# EAGLE design FAL65816_Audio (EAGLE 7.2.0)
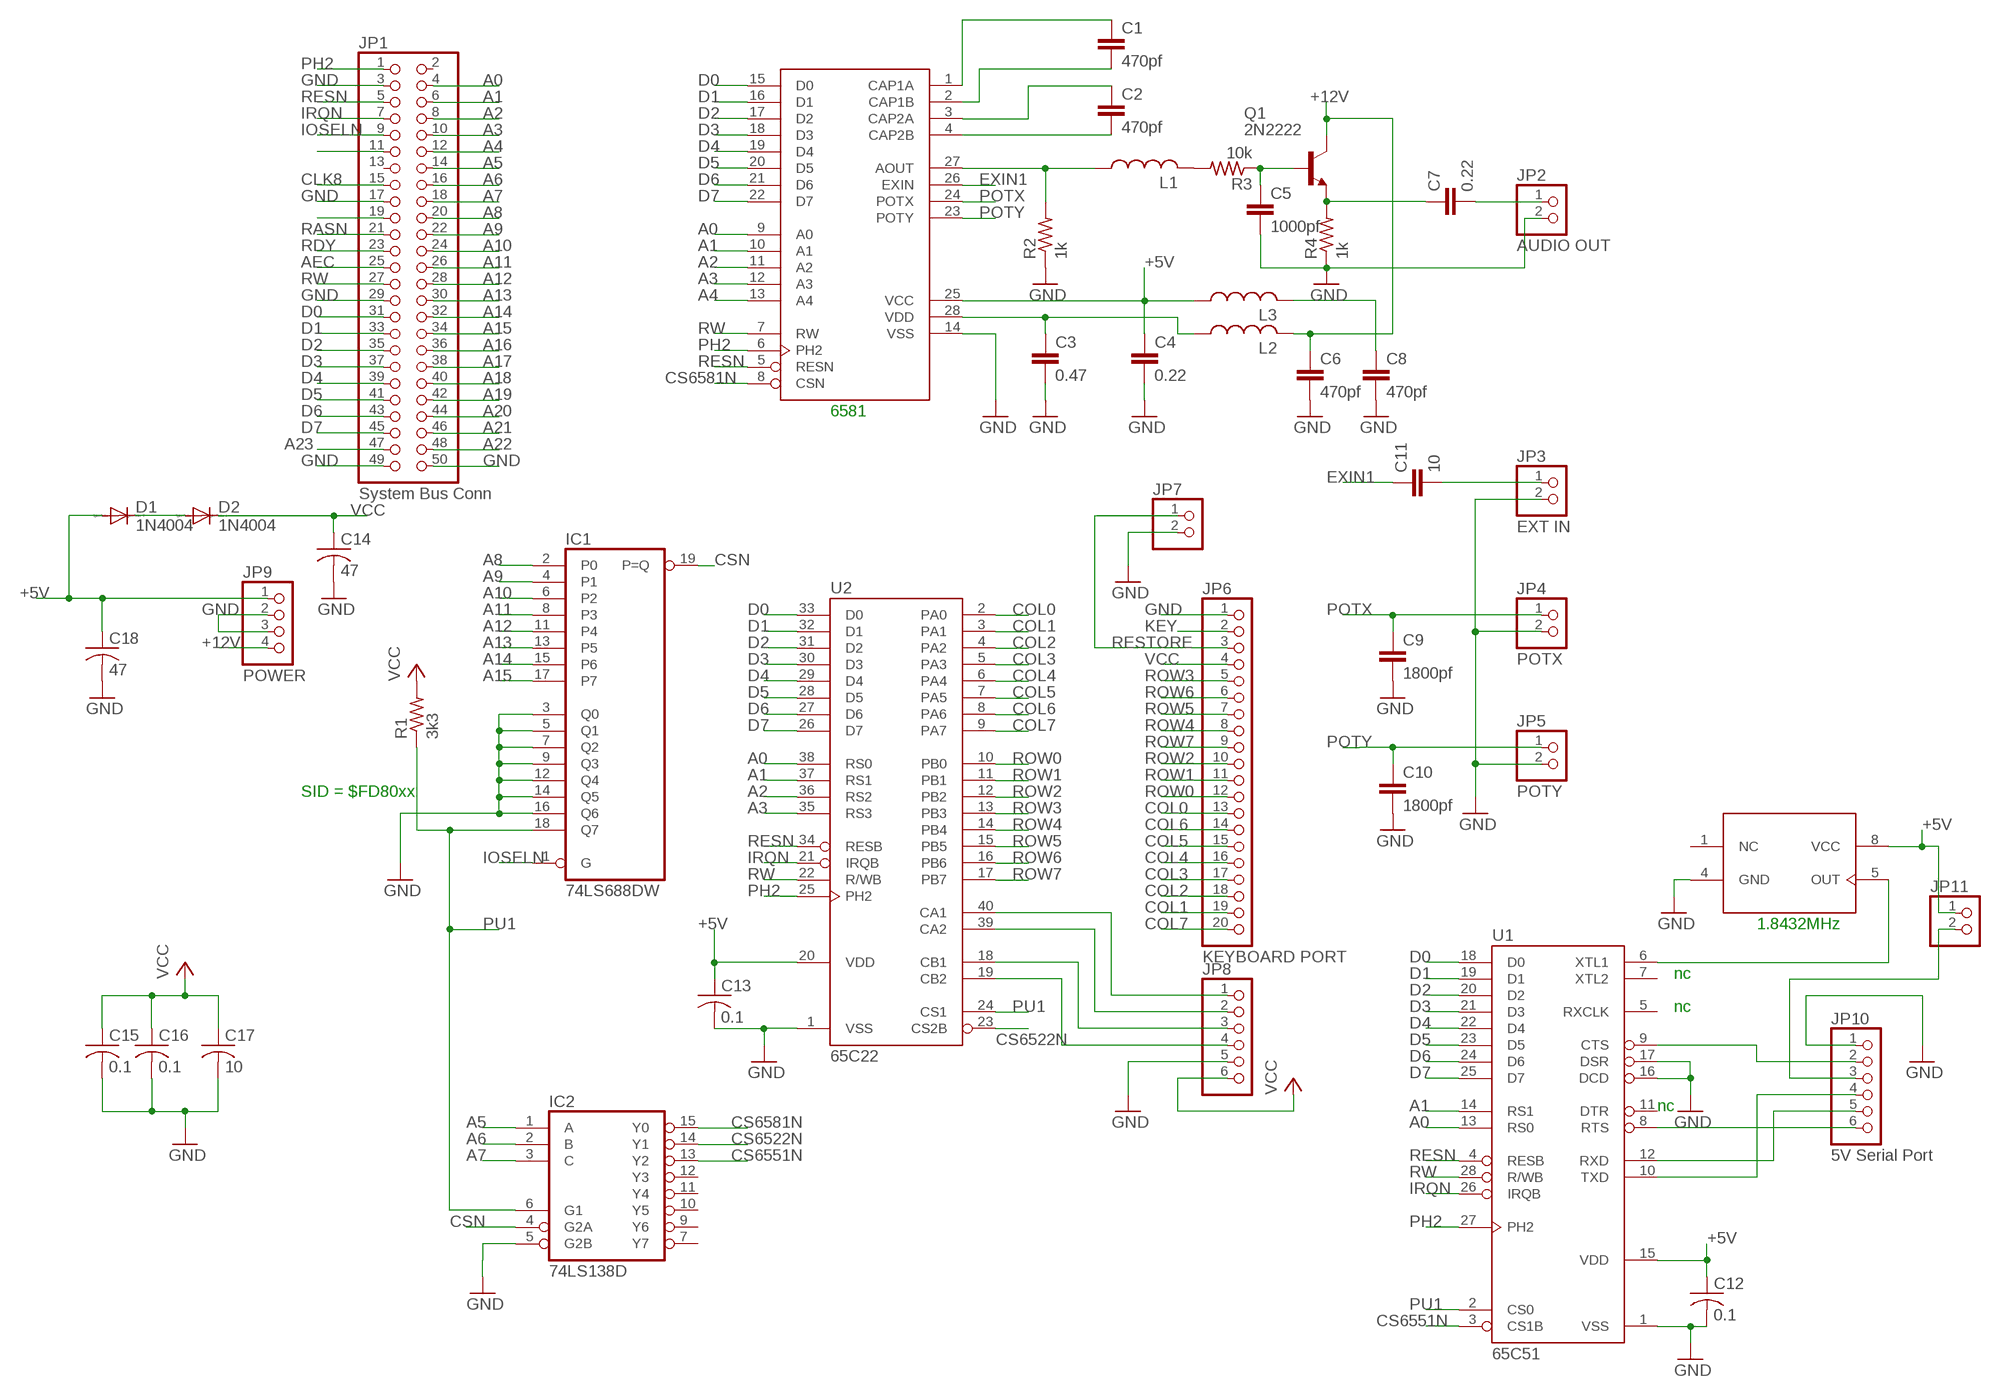
[diagram p0: schematic, sheet 1]

## Parts
C1  470pf  C-EU050-024X044  [C050-024X044]
C2  470pf  C-EU050-024X044  [C050-024X044]
C3  0.47  C-EU050-024X044  [C050-024X044]
C4  0.22  C-EU050-024X044  [C050-024X044]
C5  1000pf  C-EU050-024X044  [C050-024X044]
C6  470pf  C-EU050-024X044  [C050-024X044]
C7  0.22  C-EU050-024X044  [C050-024X044]
C8  470pf  C-EU050-024X044  [C050-024X044]
C9  1800pf  C-EU050-024X044  [C050-024X044]
C10  1800pf  C-EU050-024X044  [C050-024X044]
C11  10  C-EU050-024X044  [C050-024X044]
C12  0.1  C-US050-024X044  [C050-024X044]
C13  0.1  C-US050-024X044  [C050-024X044]
C14  47  C-US050-024X044  [C050-024X044]
C15  0.1  C-US050-024X044  [C050-024X044]
C16  0.1  C-US050-024X044  [C050-024X044]
C17  10  C-US050-024X044  [C050-024X044]
C18  47  C-US050-024X044  [C050-024X044]
D1  1N4004  [DO41-10]
D2  1N4004  [DO41-10]
IC1  74LS688DW  [SO20W]
IC2  74LS138D  [SO16]
JP1  System Bus Conn  PINHD-2X25/90  [2X25/90]
JP2  AUDIO OUT  PINHD-1X2  [1X02]
JP3  EXT IN  PINHD-1X2  [1X02]
JP4  POTX  PINHD-1X2  [1X02]
JP5  POTY  PINHD-1X2  [1X02]
JP6  KEYBOARD PORT  PINHD-1X20  [1X20]
JP7  PINHD-1X2  [1X02]
JP8  PINHD-1X6/90  [1X06/90]
JP9  POWER  PINHD-1X4/90  [1X04/90]
JP10  5V Serial Port  PINHD-1X6/90  [1X06/90]
JP11  PINHD-1X2  [1X02]
L1  L-US0204/7  [0204/7]
L2  L-US0204/7  [0204/7]
L3  L-US0204/7  [0204/7]
Q1  2N2222  [TO18]
R1  3k3  R-US_0204/7  [0204/7]
R2  1k  R-US_0204/7  [0204/7]
R3  10k  R-US_0204/7  [0204/7]
R4  1k  R-US_0204/7  [0204/7]
U1  65C51  G65SC51P  [DIP-28]
U2  65C22  G65SC22P  [DIP-40]
U$1  6581  FT6581  [DIP-28]
U$2  1.8432MHz  OSC  [DIL08]

## Nets
+5V: C4.1 C12.1 C13.1 C18.1 D1.A JP9.1 JP11.1 L3.1 U1.15(VDD) U2.20(VDD) U$1.25(VCC) U$2.8(VCC)
+12V: C6.1 JP9.4 L2.2 Q1.3(C)
A0: JP1.4 U1.13(RS0) U2.38(RS0) U$1.9(A0)
A1: JP1.6 U1.14(RS1) U2.37(RS1) U$1.10(A1)
A2: JP1.8 U2.36(RS2) U$1.11(A2)
A3: JP1.10 U2.35(RS3) U$1.12(A3)
A4: JP1.12 U$1.13(A4)
A5: IC2.1(A) JP1.14
A6: IC2.2(B) JP1.16
A7: IC2.3(C) JP1.18
A8: IC1.2(P0) JP1.20
A9: IC1.4(P1) JP1.22
A10: IC1.6(P2) JP1.24
A11: IC1.8(P3) JP1.26
A12: IC1.11(P4) JP1.28
A13: IC1.13(P5) JP1.30
A14: IC1.15(P6) JP1.32
A15: IC1.17(P7) JP1.34
A16: JP1.36
A17: JP1.38
A18: JP1.40
A19: JP1.42
A20: JP1.44
A21: JP1.46
A22: JP1.48
A23: JP1.47
AEC: JP1.25
CLK8: JP1.15
COL0: JP6.13 U2.2(PA0)
COL1: JP6.19 U2.3(PA1)
COL2: JP6.18 U2.4(PA2)
COL3: JP6.17 U2.5(PA3)
COL4: JP6.16 U2.6(PA4)
COL5: JP6.15 U2.7(PA5)
COL6: JP6.14 U2.8(PA6)
COL7: JP6.20 U2.9(PA7)
CS6522N: IC2.14(Y1) U2.23(CS2B)
CS6551N: IC2.13(Y2) U1.3(CS1B)
CS6581N: IC2.15(Y0) U$1.8(CSN)
CSN: IC1.19(P=Q) IC2.4(G2A)
D0: JP1.31 U1.18(D0) U2.33(D0) U$1.15(D0)
D1: JP1.33 U1.19(D1) U2.32(D1) U$1.16(D1)
D2: JP1.35 U1.20(D2) U2.31(D2) U$1.17(D2)
D3: JP1.37 U1.21(D3) U2.30(D3) U$1.18(D3)
D4: JP1.39 U1.22(D4) U2.29(D4) U$1.19(D4)
D5: JP1.41 U1.23(D5) U2.28(D5) U$1.20(D5)
D6: JP1.43 U1.24(D6) U2.27(D6) U$1.21(D6)
D7: JP1.45 U1.25(D7) U2.26(D7) U$1.22(D7)
EXIN1: C11.1 U$1.26(EXIN)
GND: C3.2 C4.2 C5.2 C6.2 C8.2 C9.2 C10.2 C12.2 C13.2 C14.2 C15.2 C16.2 C17.2 C18.2 IC1.3(Q0) IC1.5(Q1) IC1.7(Q2) IC1.9(Q3) IC1.12(Q4) IC1.14(Q5) IC1.16(Q6) IC2.5(G2B) JP1.3 JP1.17 JP1.29 JP1.49 JP1.50 JP2.2 JP3.2 JP4.2 JP5.2 JP6.1 JP7.2 JP8.5 JP9.2 JP9.3 JP10.1 R2.1 R4.1 U1.1(VSS) U1.16(DCD) U1.17(DSR) U2.1(VSS) U$1.14(VSS) U$2.4(GND)
IOSELN: IC1.1(G) JP1.9
IRQN: JP1.7 U1.26(IRQB) U2.21(IRQB)
KEY: JP6.2
N$1: C1.1 U$1.1(CAP1A)
N$2: C1.2 U$1.2(CAP1B)
N$3: C2.1 U$1.3(CAP2A)
N$4: C2.2 U$1.4(CAP2B)
N$5: L1.1 R2.2 U$1.27(AOUT)
N$6: C3.1 L2.1 U$1.28(VDD)
N$7: L1.2 R3.2
N$8: C5.1 Q1.2(B) R3.1
N$9: C7.1 Q1.1(E) R4.2
N$10: D1.C D2.A
N$11: C7.2 JP2.1
N$12: C8.1 L3.2
N$14: JP10.3 JP11.2
N$16: C11.2 JP3.1
N$17: JP10.2 U1.9(CTS)
N$18: JP1.19
N$20: JP10.4 U1.10(TXD)
N$21: JP10.5 U1.12(RXD)
N$22: JP10.6 U1.8(RTS)
N$23: JP8.1 U2.40(CA1)
N$24: JP8.2 U2.39(CA2)
N$25: JP8.3 U2.18(CB1)
N$26: JP8.4 U2.19(CB2)
N$28: U1.6(XTL1) U$2.5(OUT)
N$40: JP1.11
PH2: JP1.1 U1.27(PH2) U2.25(PH2) U$1.6(PH2)
POTX: C9.1 JP4.1 U$1.24(POTX)
POTY: C10.1 JP5.1 U$1.23(POTY)
PU1: IC1.18(Q7) IC2.6(G1) R1.1 U1.2(CS0) U2.24(CS1)
RASN: JP1.21
RDY: JP1.23
RESN: JP1.5 U1.4(RESB) U2.34(RESB) U$1.5(RESN)
RESTORE: JP6.3 JP7.1
ROW0: JP6.12 U2.10(PB0)
ROW1: JP6.11 U2.11(PB1)
ROW2: JP6.10 U2.12(PB2)
ROW3: JP6.5 U2.13(PB3)
ROW4: JP6.8 U2.14(PB4)
ROW5: JP6.7 U2.15(PB5)
ROW6: JP6.6 U2.16(PB6)
ROW7: JP6.9 U2.17(PB7)
RW: JP1.27 U1.28(R/WB) U2.22(R/WB) U$1.7(RW)
VCC: C14.1 C15.1 C16.1 C17.1 D2.C JP6.4 JP8.6 R1.2
Unconnected: IC2.7(Y7) IC2.9(Y6) IC2.10(Y5) IC2.11(Y4) IC2.12(Y3) JP1.2 JP1.13 U1.5(RXCLK) U1.7(XTL2) U1.11(DTR) U$2.1(NC)

## Notes on the sheet
- 6581
- SID = $FD80xx
- 1.8432MHz
- nc
- nc
- nc

## Power pins joined to a net without a drawn wire
GND: IC1.10(GND) IC2.8(GND)
VCC: IC1.20(VCC) IC2.16(VCC)

## Library data of the parts
C1-C11 = rcl:C-EU: CAPACITOR, European symbol
C12-C18 = resistor:C-US: CAPACITOR, American symbol
D1 D2 = diode:1N4004: DIODE general purpose rectifier, 1 A
IC1 = FT74xx:74*688: 8-bit MAGNITUDE/IDENTITY COMPARATOR, totem pole
IC2 = FT74xx:74*138: 3-line to 8-line DECODER/DEMULTIPLEXER
JP1 = pinhead:PINHD-2X25: PIN HEADER
JP2-JP5 JP7 JP11 = pinhead:PINHD-1X2: PIN HEADER
JP6 = pinhead:PINHD-1X20: PIN HEADER
JP8 JP10 = pinhead:PINHD-1X6: PIN HEADER
JP9 = pinhead:PINHD-1X4: PIN HEADER
L1-L3 = resistor:L-US: INDUCTOR, American symbol
Q1 = transistor-npn:2N2222*: NPN Transistor
R1-R4 = resistor:R-US_: RESISTOR, American symbol
U1 = 65xxx:G65SC51P: California Micro Devices Version
U2 = 65xxx:G65SC22P: California Micro Devices Version
U$1 = 65xxx:FT6581: Sound interface device
U$2 = FT74xx:OSC

## Board
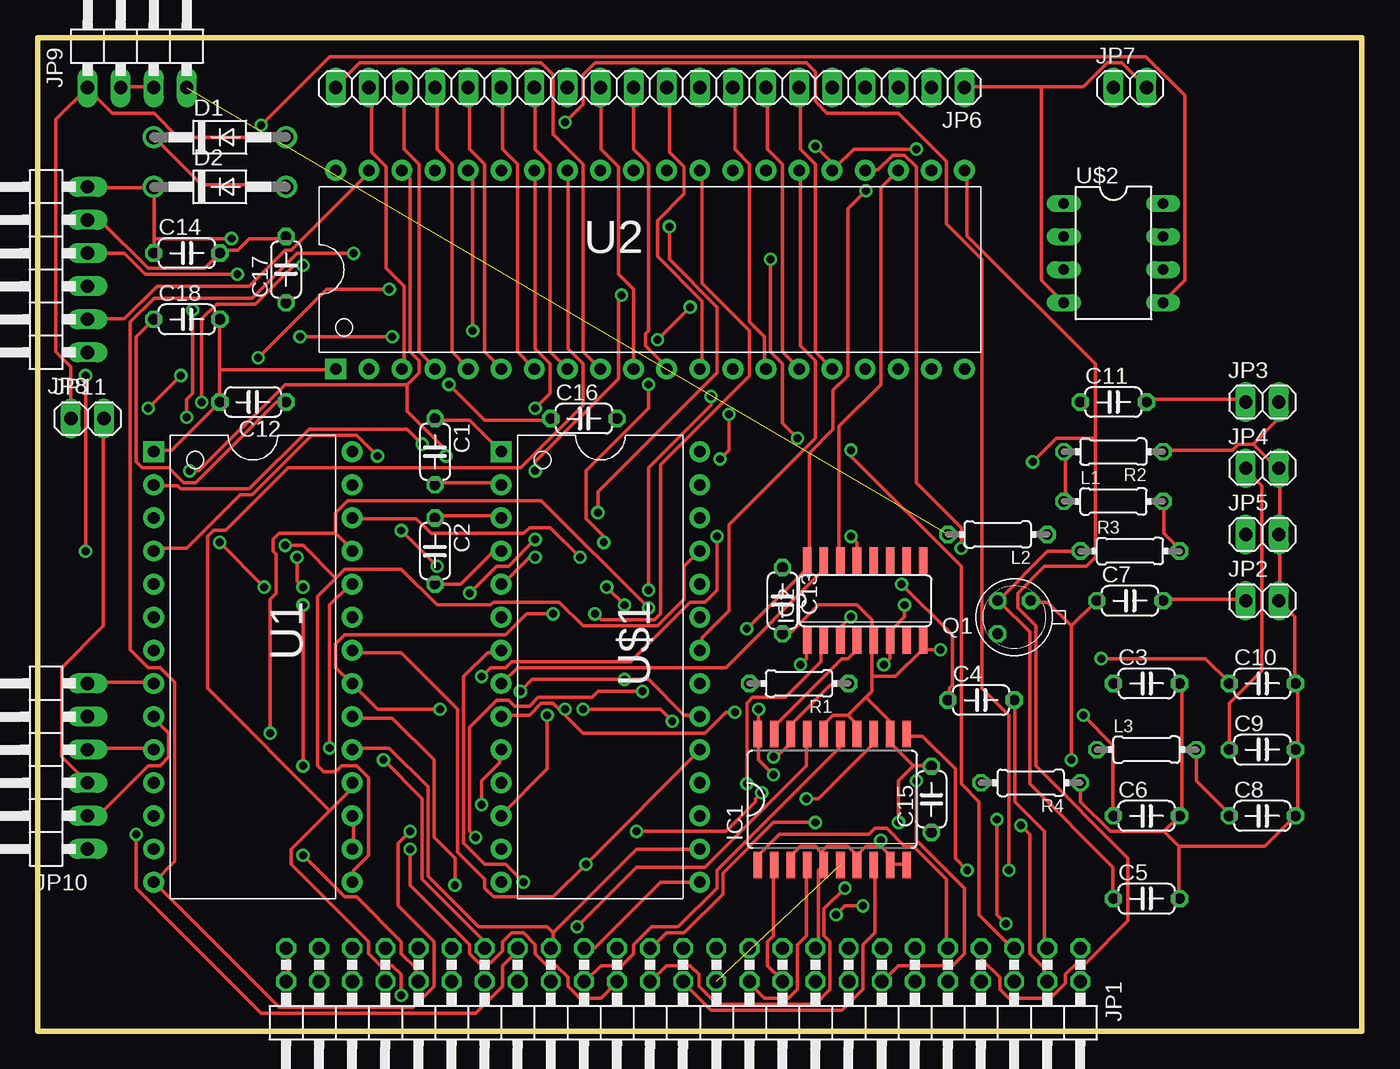
[diagram p1: board, top side]
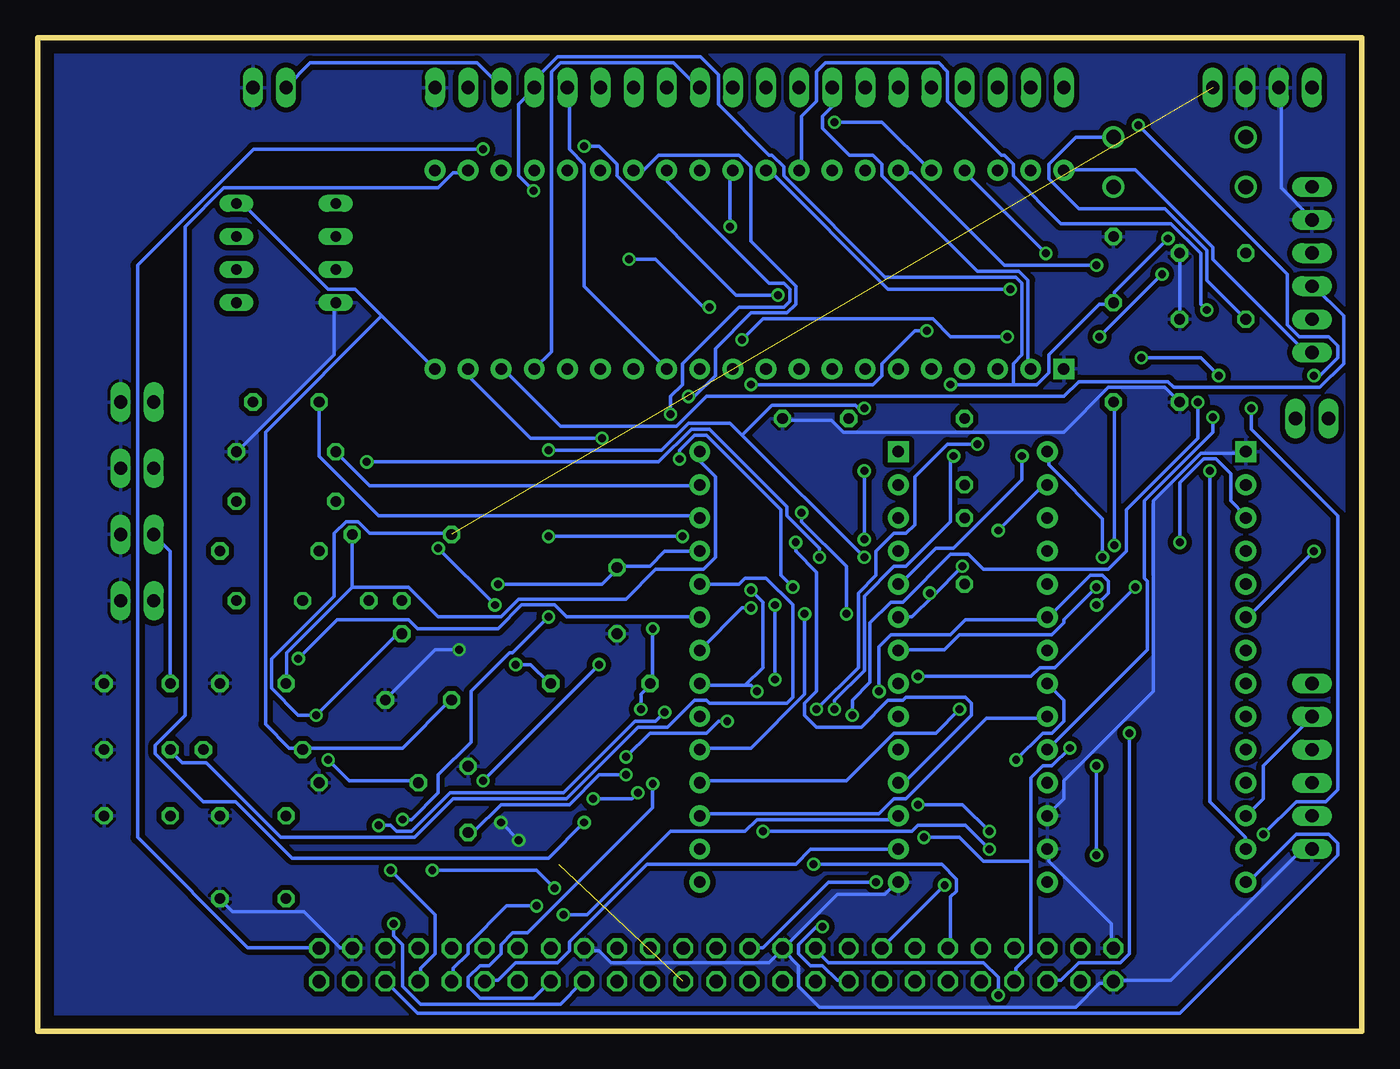
[diagram p2: board, bottom side, seen from below]

Size 101.6 x 76.2 mm. Coordinates in mm from the lower left corner, seen from the top.
Outline: 0,0 0,76.2 101.6,76.2 101.6,0 0,0
Copper layers (1*16): Top 0.035mm / dielectric 1.5mm / Bottom 0.035mm
Design rules "default": minimum track width 10mil, minimum drill 24mil, track to track 8mil, track to pad 8mil, pad to pad 8mil, via to via 8mil, smd to smd 8mil, copper to edge 40mil, drill to drill 8mil, minimum pad ring 10mil, minimum via ring 8mil, stop-mask expansion 4mil, vias tented up to drill 0mil, thermal gap 10mil

### Footprints (pad centres in the part's own frame; a part is rotated, then mirrored left to right if it is on the bottom)
C050-024X044 = drill 0.813 octagon: 1 -2.54,0; 2 2.54,0
DO41-10 = drill 1.118: A 5.08,0; C -5.08,0
SO20W = smd 0.66 x 2.032: 1 -5.715,-5.029; 2 -4.445,-5.029; 3 -3.175,-5.029; 4 -1.905,-5.029; 5 -0.635,-5.029; 6 0.635,-5.029; 7 1.905,-5.029; 8 3.175,-5.029; 9 4.445,-5.029; 10 5.715,-5.029; 11 5.715,5.029; 12 4.445,5.029; 13 3.175,5.029; 14 1.905,5.029; 15 0.635,5.029; 16 -0.635,5.029; 17 -1.905,5.029; 18 -3.175,5.029; 19 -4.445,5.029; 20 -5.715,5.029
SO16 = smd 0.66 x 2.032: 1 -4.445,-3.073; 2 -3.175,-3.073; 3 -1.905,-3.073; 4 -0.635,-3.073; 5 0.635,-3.073; 6 1.905,-3.073; 7 3.175,-3.073; 8 4.445,-3.073; 9 4.445,3.073; 10 3.175,3.073; 11 1.905,3.073; 12 0.635,3.073; 13 -0.635,3.073; 14 -1.905,3.073; 15 -3.175,3.073; 16 -4.445,3.073
2X25/90 = drill 1.016 octagon: 1 -29.21,-6.35; 2 -29.21,-3.81; 3 -26.67,-6.35; 4 -26.67,-3.81; 5 -24.13,-6.35; 6 -24.13,-3.81; 7 -21.59,-6.35; 8 -21.59,-3.81; 9 -19.05,-6.35; 10 -19.05,-3.81; 11 -16.51,-6.35; 12 -16.51,-3.81; 13 -13.97,-6.35; 14 -13.97,-3.81; 15 -11.43,-6.35; 16 -11.43,-3.81; 17 -8.89,-6.35; 18 -8.89,-3.81; 19 -6.35,-6.35; 20 -6.35,-3.81; 21 -3.81,-6.35; 22 -3.81,-3.81; 23 -1.27,-6.35; 24 -1.27,-3.81; 25 1.27,-6.35; 26 1.27,-3.81; 27 3.81,-6.35; 28 3.81,-3.81; 29 6.35,-6.35; 30 6.35,-3.81; 31 8.89,-6.35; 32 8.89,-3.81; 33 11.43,-6.35; 34 11.43,-3.81; 35 13.97,-6.35; 36 13.97,-3.81; 37 16.51,-6.35; 38 16.51,-3.81; 39 19.05,-6.35; 40 19.05,-3.81; 41 21.59,-3.81; 42 21.59,-6.35; 43 24.13,-3.81; 44 24.13,-6.35; 45 26.67,-3.81; 46 26.67,-6.35; 47 29.21,-3.81; 48 29.21,-6.35; 49 31.75,-3.81; 50 31.75,-6.35
1X02 = drill 1.016 long: 1 -1.27,0; 2 1.27,0
1X20 = drill 1.016 long: 1 -24.13,0; 2 -21.59,0; 3 -19.05,0; 4 -16.51,0; 5 -13.97,0; 6 -11.43,0; 7 -8.89,0; 8 -6.35,0; 9 -3.81,0; 10 -1.27,0; 11 1.27,0; 12 3.81,0; 13 6.35,0; 14 8.89,0; 15 11.43,0; 16 13.97,0; 17 16.51,0; 18 19.05,0; 19 21.59,0; 20 24.13,0
1X06/90 = drill 1.016 long: 1 -6.35,-3.81; 2 -3.81,-3.81; 3 -1.27,-3.81; 4 1.27,-3.81; 5 3.81,-3.81; 6 6.35,-3.81
1X04/90 = drill 1.016 long: 1 -3.81,-3.81; 2 -1.27,-3.81; 3 1.27,-3.81; 4 3.81,-3.81
0204/7 = drill 0.813 octagon: 1 -3.81,0; 2 3.81,0
TO18 = drill 0.813 octagon: 1 -1.27,-1.27; 2 1.27,-1.27; 3 1.27,1.27
DIP-28 = drill 0.889 pad 1.6 square: 1 -15.24,-7.62 | drill 0.889 pad 1.6: 2 -12.7,-7.62; 3 -10.16,-7.62; 4 -7.62,-7.62; 5 -5.08,-7.62; 6 -2.54,-7.62; 7 0,-7.62; 8 2.54,-7.62; 9 5.08,-7.62; 10 7.62,-7.62; 11 10.16,-7.62; 12 12.7,-7.62; 13 15.24,-7.62; 14 17.78,-7.62; 15 17.78,7.62; 16 15.24,7.62; 17 12.7,7.62; 18 10.16,7.62; 19 7.62,7.62; 20 5.08,7.62; 21 2.54,7.62; 22 0,7.62; 23 -2.54,7.62; 24 -5.08,7.62; 25 -7.62,7.62; 26 -10.16,7.62; 27 -12.7,7.62; 28 -15.24,7.62
DIP-40 = drill 0.889 pad 1.6 square: 1 -22.86,-7.62 | drill 0.889 pad 1.6: 2 -20.32,-7.62; 3 -17.78,-7.62; 4 -15.24,-7.62; 5 -12.7,-7.62; 6 -10.16,-7.62; 7 -7.62,-7.62; 8 -5.08,-7.62; 9 -2.54,-7.62; 10 0,-7.62; 11 2.54,-7.62; 12 5.08,-7.62; 13 7.62,-7.62; 14 10.16,-7.62; 15 12.7,-7.62; 16 15.24,-7.62; 17 17.78,-7.62; 18 20.32,-7.62; 19 22.86,-7.62; 20 25.4,-7.62; 21 25.4,7.62; 22 22.86,7.62; 23 20.32,7.62; 24 17.78,7.62; 25 15.24,7.62; 26 12.7,7.62; 27 10.16,7.62; 28 7.62,7.62; 29 5.08,7.62; 30 2.54,7.62; 31 0,7.62; 32 -2.54,7.62; 33 -5.08,7.62; 34 -7.62,7.62; 35 -10.16,7.62; 36 -12.7,7.62; 37 -15.24,7.62; 38 -17.78,7.62; 39 -20.32,7.62; 40 -22.86,7.62
DIL08 = drill 0.813 long: 1 -3.81,-3.81; 2 -1.27,-3.81; 3 1.27,-3.81; 4 3.81,-3.81; 5 3.81,3.81; 6 1.27,3.81; 7 -1.27,3.81; 8 -3.81,3.81

### Placement (x,y rotation side)
C1  30.48,44.45 270 top
C2  30.48,36.83 270 top
C3  85.09,26.67 0 top
C4  72.39,25.4 0 top
C5  85.09,10.16 0 top
C6  85.09,16.51 0 top
C7  83.82,33.02 0 top
C8  93.98,16.51 0 top
C9  93.98,21.59 0 top
C10  93.98,26.67 0 top
C11  82.55,48.26 0 top
C12  16.51,48.26 180 top
C13  57.15,33.02 270 top
C14  11.43,59.69 0 top
C15  68.58,17.78 90 top
C16  41.91,46.99 0 top
C17  19.05,58.42 90 top
C18  11.43,54.61 0 top
D1  13.97,68.58 0 top
D2  13.97,64.77 0 top
IC1  60.96,17.78 0 top
IC2  63.5,33.02 0 top
JP1  50.8,0 180 top
JP2  93.98,33.02 0 top
JP3  93.98,48.26 0 top
JP4  93.98,43.18 0 top
JP5  93.98,38.1 0 top
JP6  46.99,72.39 180 top
JP7  83.82,72.39 0 top
JP8  0,58.42 90 top
JP9  7.62,76.2 0 top
JP10  0,20.32 90 top
JP11  3.81,46.99 0 top
L1  82.55,40.64 0 top
L2  73.66,38.1 180 top
L3  85.09,21.59 0 top
Q1  74.93,31.75 180 top
R1  58.42,26.67 180 top
R2  82.55,44.45 180 top
R3  83.82,36.83 0 top
R4  76.2,19.05 180 top
U1  16.51,29.21 270 top
U2  45.72,58.42 0 top
U$1  43.18,29.21 270 top
U$2  82.55,59.69 270 top

### Tracks (layer width: path | path; a pad name or v marks a point on that pad's centre or on a via)
+5V  (via drill 0.61)
  Top 0.254: C18.1 7.54,53.26 7.54,43.66 8,43.2 10.06,43.2 11.2,42.06 12.12,42.06 18.29,48.23 18.97,48.23 C12.1 | JP11.1 2.52,47.09 2.52,50.98 1.37,52.12 1.37,69.95 JP9.1 3.89,72.24 5.71,70.41 8.91,70.41 10.74,68.58 D1.A | 22.86,34.75 23.55,35.43 27.89,35.43 30.63,32.69 34.75,32.69 34.98,32.92 40.01,32.92 41.83,31.09 47.55,31.09 49.61,33.15 49.61,35.66 50.75,36.8 U$1.25 | 22.86,34.75 21.49,33.38 21.49,20.34 21.95,19.89 22.86,19.89 23.32,20.34 24.46,20.34 25.38,19.43 25.38,13.49 24.23,12.34 24.23,11.43 U1.15 | v18.97,37.26 20.34,37.26 22.86,34.75 | v66.29,34.29 70.18,30.4 70.18,26.52 69.95,26.29 69.95,25.6 C4.1
  Bottom 0.254: C4.1 69.95,25.38 73.61,21.72 81.15,21.72 L3.1 81.38,21.72 82.3,21.72 84.12,23.55 84.12,45.95 75.21,54.86 | 75.21,54.86 71.32,50.98 U2.20 | 75.21,54.86 77.27,56.92 79.32,56.92 85.72,63.32 86.18,63.32 U$2.8 | C18.1 11.89,57.61 11.89,59.89 15.09,63.09 21.72,63.09 24,65.38 24,66.52 21.95,68.58 D1.A | U$1.25 50.98,36.8 53.49,36.8 54.63,35.66 57.15,35.66 C13.1 57.15,35.43 58.29,34.29 v66.29,34.29 | v18.97,37.26 18.97,48.23 C12.1
+12V  (via drill 0.61)  (1 unrouted)
  Top 0.254: v80.24,24.23 82.53,21.95 82.53,16.69 C6.1
  Bottom 0.254: Q1.3 73.84,30.63 v80.24,24.23 81.61,24.23 83.67,26.29 83.67,28.57 78.87,33.38 78.87,38.18 77.95,39.09 77.04,39.09 76.12,38.18 69.95,38.18 L2.2
A0  (via drill 0.61)
  Top 0.254: v75.44,15.77 76.12,15.09 76.12,5.94 77.27,4.8 77.27,3.89 JP1.4 | v53.49,24.46 52.81,24.46 51.21,22.86 41.83,22.86 40.23,24.46 | 40.23,24.46 39.55,25.15 38.63,25.15 37.72,24.23 35.66,24.23 U$1.9 | v11.66,42.98 12.34,42.98 18.97,49.61 28.35,49.61 | 28.35,49.61 29.26,50.52 29.26,51.44 28.57,52.12 28.57,65.38 28.12,65.84 U2.38 | v40.46,24.69 40.23,24.46 | v31.32,44.12 31.32,44.58 28.35,47.55 28.35,49.61
  Bottom 0.254: v75.44,15.77 74.52,15.77 74.07,15.32 72.92,15.32 69.95,18.29 61.27,18.29 55.78,23.77 54.18,23.77 v53.49,24.46 | v11.66,42.98 11.66,17.6 8.91,14.86 8.91,14.17 U1.13 | v40.46,24.69 40.46,25.38 38.18,27.66 38.18,33.38 35.89,35.66 34.98,35.66 31.55,39.09 31.55,43.89 v31.32,44.12
A1  (via drill 0.61)
  Top 0.254: v34.06,17.37 34.06,19.2 35.43,20.57 35.43,21.49 U$1.10 | v28.57,15.32 27.66,14.4 27.66,9.6 30.4,6.86 30.4,3.43 28.8,1.83 18.52,1.83 8.91,11.43 | v24.23,59.66 19.89,59.66 16.46,56.24 8.91,56.24 7.09,54.41 7.09,29.26 8.46,27.89 9.37,27.89 10.52,26.75 10.52,13.03 8.91,11.43 | 8.91,11.43 U1.14
  Bottom 0.254: JP1.6 74.75,3.66 72.47,1.37 13.95,1.37 1.83,13.49 1.83,14.4 2.52,15.09 5.03,15.09 8.69,11.43 U1.14 | v34.06,17.37 30.63,17.37 v28.57,15.32 | v24.23,59.66 30.4,65.84 U2.37
A2  (via drill 0.61)
  Top 0.254: v74.52,12.34 74.52,24.23 72.47,26.29 72.47,59.21 69.72,61.95 69.72,66.75 66.06,70.41 60.58,70.41 59.66,71.32 59.66,73.61 58.98,74.3 42.75,74.3 41.83,73.38 41.83,71.09 v40.46,69.72 | v43.43,37.49 43.43,37.95 42.06,39.32 42.06,42.98 46.86,47.78 v46.86,49.61 | v33.38,53.72 33.38,65.61 33.15,65.84 U2.36
  Bottom 0.254: v74.52,12.34 71.09,8.91 71.09,5.94 72.24,4.8 72.24,3.89 JP1.8 | v40.46,69.72 36.8,69.72 33.15,66.06 U2.36 | v43.43,37.49 43.43,36.8 41.83,35.2 41.83,26.06 42.75,25.15 42.75,24.23 41.83,23.32 38.41,23.32 36.35,25.38 35.2,25.38 34.98,25.6 30.4,25.6 29.95,25.15 29.95,24.23 34.98,19.2 35.43,19.2 U$1.11 | v46.86,49.61 37.49,49.61 36.8,50.29 36.8,51.21 34.29,53.72 v33.38,53.72
A3  (via drill 0.61)
  Top 0.254: v63.32,9.6 61.95,9.6 v61.27,8.91 | v20.34,58.75 19.66,58.75 16.69,55.78 13.72,55.78 12.57,54.63 v12.57,48.23 | v39.09,24.23 39.09,20.12 35.66,16.69 U$1.12
  Bottom 0.254: v63.32,9.6 65.61,9.6 68.58,6.63 68.58,5.94 69.72,4.8 69.72,3.89 JP1.10 | v61.27,8.91 59.44,8.91 53.03,15.32 47.32,15.32 46.41,16.23 35.89,16.23 35.66,16.46 U$1.12 | v20.34,58.75 27.43,58.75 34.52,65.84 35.43,65.84 U2.35 | v12.57,48.23 12.57,45.49 18.06,40.01 18.06,36.8 19.43,35.43 29.03,35.43 30.18,36.58 31.55,36.58 35.2,32.92 36.12,32.92 37.72,31.32 37.72,26.75 39.09,25.38 v39.09,24.23
A4
  Bottom 0.254: JP1.12 67.21,3.89 66.29,3.89 64.92,5.26 61.72,5.26 60.81,6.17 60.81,6.86 54.86,12.8 43.43,12.8 42.29,13.95 35.66,13.95 U$1.13
A5  (via drill 0.61)
  Top 0.254: v58.52,28.12 58.98,28.57 58.98,29.95 IC2.1 | v67.44,19.2 67.44,14.63 71.09,10.97 71.09,5.94 70.18,5.03 66.06,5.03 64.92,3.89 JP1.14
  Bottom 0.254: v67.44,19.2 v58.52,28.12
A6  (via drill 0.61)
  Top 0.254: v54.41,18.97 54.41,25.15 54.86,25.6 57.38,25.6 60.12,28.35 60.12,29.95 IC2.2
  Bottom 0.254: v54.41,18.97 54.41,17.14 64.01,7.54 65.15,7.54 66.06,6.63 66.06,5.94 66.98,5.03 67.67,5.03 68.58,4.12 68.58,3.43 67.67,2.52 63.55,2.52 62.41,3.66 JP1.16
A7  (via drill 0.61)
  Top 0.254: v62.41,31.77 61.72,31.09 61.72,29.95 IC2.3 | v73.61,16.23 73.61,8.91 v74.3,8.23
  Bottom 0.254: v62.41,31.77 65.15,29.03 65.38,29.03 68.35,26.06 68.35,22.17 70.87,19.66 70.87,18.29 72.92,16.23 v73.61,16.23 | v74.3,8.23 74.3,7.32 73.61,6.63 73.61,3.43 72.24,2.06 61.49,2.06 59.89,3.66 JP1.18
A8
  Top 0.254: IC1.2 56.46,12.57 56.46,7.32 56.01,6.86 56.01,5.03 57.15,3.89 JP1.20
A9
  Top 0.254: IC1.4 58.98,12.57 58.98,7.32 58.29,6.63 58.29,3.2 57.61,2.52 55.78,2.52 54.63,3.66 JP1.22
A10  (1 unrouted)
A11
  Top 0.254: IC1.8 64.24,12.57 64.24,7.54 63.32,6.63 63.32,3.2 61.72,1.6 51.66,1.6 49.61,3.66 JP1.26
A12  (via drill 0.61)
  Top 0.254: v71.32,12.34 70.41,13.26 70.41,20.12 67.89,22.63 66.75,22.63 IC1.11 | v61.95,10.97 60.35,9.37 60.35,7.32 60.81,6.86 60.81,3.2 59.66,2.06 52.12,2.06 50.75,3.43 50.75,4.34 50.06,5.03 48.23,5.03 47.09,3.89 JP1.28
  Bottom 0.254: v71.32,12.34 63.32,12.34 v61.95,10.97
A13  (via drill 0.61)
  Top 0.254: v58.98,17.83 59.89,17.83 64.01,21.95 64.01,22.63 IC1.13 | v55.55,18.29 55.09,17.83 55.09,17.6 52.81,15.32 v45.95,15.32 | v28.57,13.95 28.57,11.2 33.15,6.63 33.15,5.94 33.83,5.26 34.75,5.26 35.66,6.17 35.66,6.86 36.35,7.54 37.26,7.54 38.18,6.63 38.18,5.94 39.09,5.03 39.78,5.03 40.69,4.12 40.69,3.43 41.6,2.52 43.2,2.52 44.35,3.66 JP1.30
  Bottom 0.254: v58.98,17.83 56.01,17.83 v55.55,18.29 | v45.95,15.32 34.52,15.32 34.06,15.77 30.4,15.77 v28.57,13.95
A14
  Top 0.254: IC1.15 61.49,22.63 61.49,21.72 52.12,12.34 52.12,10.97 49.15,8 47.09,8 45.72,6.63 45.72,5.94 44.81,5.03 43.2,5.03 42.06,3.89 JP1.32
A15  (via drill 0.61)
  Top 0.254: v41.38,8 45.95,12.57 51.21,12.57 58.98,20.34 58.98,22.63 IC1.17
  Bottom 0.254: v41.38,8 41.83,8 43.2,6.63 43.2,5.94 42.29,5.03 41.38,5.03 40.23,3.89 39.55,3.89 JP1.34
COL0
  Bottom 0.254: JP6.13 40.69,72.24 40.69,70.87 41.38,70.18 41.38,69.27 39.32,67.21 37.49,67.21 36.8,66.52 36.8,65.61 29.49,58.29 26.29,58.29 25.6,57.61 25.6,50.98 U2.2
COL1
  Top 0.254: JP6.19 25.6,72.24 25.6,67.44 26.75,66.29 26.75,58.52 28.12,57.15 28.12,50.98 U2.3
COL2
  Top 0.254: JP6.18 28.12,72.24 28.12,67.67 29.26,66.52 29.26,52.12 30.4,50.98 U2.4
COL3
  Top 0.254: JP6.17 30.63,72.24 30.63,67.67 31.77,66.52 31.77,52.12 32.92,50.98 U2.5
COL4
  Top 0.254: JP6.16 33.15,72.24 33.15,67.67 34.29,66.52 34.29,52.12 35.43,50.98 U2.6
COL5
  Top 0.254: JP6.15 35.66,72.24 35.66,67.67 36.8,66.52 36.8,52.12 37.95,50.98 U2.7
COL6
  Top 0.254: U2.8 39.32,52.12 39.32,66.52 38.18,67.67 38.18,72.24 JP6.14
COL7
  Top 0.254: JP6.20 22.86,72.47 24.69,74.3 38.63,74.3 39.55,73.38 39.55,68.81 41.83,66.52 41.83,52.12 42.98,50.98 U2.9
CS6522N
  Top 0.254: U2.23 64.69,64.69 64.69,49.61 61.49,46.41 61.49,36.12 IC2.14
CS6551N  (via drill 0.61)
  Top 0.254: IC2.13 62.87,37.49 v62.41,37.95 | v52.12,37.95 52.12,33.83 51.21,32.92 50.06,32.92 45.49,28.35 36.35,28.35 35.89,27.89 34.75,27.89 v34.06,27.2 | v13.95,37.49 v17.37,34.06
  Bottom 0.254: v52.12,37.95 v62.41,37.95 | v34.06,27.2 25.38,27.2 24.69,27.89 23.55,27.89 v17.37,34.06 | v13.95,37.49 13.95,42.06 12.12,43.89 11.2,43.89 10.06,42.75 10.06,40.69 8.91,39.55 U1.3
CS6581N
  Top 0.254: IC2.15 60.12,35.89 60.12,35.2 52.81,27.89 36.8,27.89 35.66,26.75 U$1.8
CSN
  Top 0.254: IC2.4 62.87,29.26 62.18,28.57 61.72,28.57 56.69,23.55 56.69,22.86 IC1.19
D0  (via drill 0.61)
  Top 0.254: U$1.15 47.78,11.43 42.75,6.4 42.06,6.4 JP1.31 | 22.4,16.92 19.43,13.95 19.43,12.8 25.38,6.86 25.38,5.94 26.29,5.03 27.2,5.03 27.89,4.34 v27.89,2.74 | 22.4,16.92 24,18.52 24,18.97 U1.18 | 22.4,16.92 13.03,26.29 13.03,37.95 13.49,38.41 14.4,38.41 19.2,43.2 37.03,43.2 41.83,48.01 41.83,51.21 40.69,52.35 40.69,65.84 U2.33
  Bottom 0.254: v27.89,2.74 27.89,4.12 29.03,5.26 40.92,5.26 41.83,6.17 JP1.31
D1  (via drill 0.61)
  Top 0.254: 39.55,7.54 39.55,6.4 JP1.33 | 39.55,7.54 45.95,13.95 50.75,13.95 U$1.16 | 39.55,7.54 39.09,8 33.83,8 29.95,11.89 29.95,18.75 26.98,21.72 24.23,21.72 U1.19 | v11.89,55.32 11.89,48.92 11.43,48.46 v11.43,47.09
  Bottom 0.254: v11.89,55.32 12.34,55.78 12.34,59.66 14.63,61.95 23.09,61.95 26.75,65.61 26.75,66.52 27.43,67.21 27.66,67.21 31.77,71.32 31.77,73.61 32.46,74.3 41.15,74.3 41.83,73.61 41.83,71.32 42.98,70.18 42.98,66.06 U2.32 | v11.43,47.09 11.43,45.95 16.69,40.69 16.69,34.75 16.46,34.52 16.46,29.26 U1.19
D2  (via drill 0.61)
  Top 0.254: v32,11.2 32,13.26 30.4,14.86 30.4,20.8 27.2,24 24.23,24 U1.20 | v26.98,56.92 22.17,56.92 v16.92,51.66 | v8.46,47.78 v10.97,50.29 | v7.54,15.09 7.54,10.97 17.14,1.37 33.6,1.37 35.66,3.43 35.66,5.03 36.8,6.17 JP1.35
  Bottom 0.254: v32,11.2 36.8,6.4 JP1.35 | U$1.17 50.75,16.69 37.03,16.69 35.89,17.83 34.98,17.83 28.8,24 24.23,24 U1.20 | v26.98,56.92 36.35,56.92 45.26,65.84 45.72,65.84 U2.31 | v16.92,51.66 12.34,51.66 v10.97,50.29 | v8.46,47.78 8.46,46.18 1.83,39.55 1.83,18.52 2.74,17.6 5.03,17.6 v7.54,15.09
D3  (via drill 0.61)
  Top 0.254: JP1.37 34.29,6.86 29.49,11.66 29.49,17.83 v26.52,20.8 | v30.86,24.69 26.06,24.69 24.23,26.52 U1.21 24,26.75 22.86,27.89 22.86,29.72 23.55,30.4 35.89,30.4 37.49,32 v39.55,32 | v48.46,61.72 48.46,59.21 52.12,55.55 52.12,50.52 42.98,41.38 v42.98,39.78
  Bottom 0.254: v26.52,20.8 24.46,22.86 23.77,22.86 22.86,23.77 22.86,25.38 24,26.52 U1.21 | v30.86,24.69 32.69,22.86 35.89,22.86 39.55,19.2 50.75,19.2 U$1.18 | v48.46,61.72 48.46,65.84 U2.30 | v42.98,39.78 42.98,39.09 39.55,35.66 v39.55,32
D4  (via drill 0.61)
  Top 0.254: U$1.19 50.75,21.49 v42.06,12.8 39.55,10.29 34.98,10.29 34.29,10.97 34.29,11.66 32.23,13.72 32.23,24.69 27.89,29.03 24.23,29.03 U1.22 | v42.75,32 43.2,31.55 47.32,31.55 47.78,32 47.78,43.43 54.63,50.29 54.63,53.72 50.98,57.38 50.98,65.84 U2.29
  Bottom 0.254: v42.06,12.8 32.23,12.8 31.09,11.66 31.09,10.74 31.55,10.29 31.55,6.4 JP1.39 | v42.75,32 42.75,25.83 46.86,21.72 50.75,21.72 U$1.19
D5  (via drill 0.61)
  Top 0.254: v20.34,13.49 23.55,10.29 24.46,10.29 27.89,6.86 27.89,5.94 29.03,4.8 29.03,3.89 JP1.41 | v20.34,32.69 v20.34,20.34 | v37.03,26.06 37.95,26.98 v45.03,26.98 46.86,26.98 49.61,24.23 50.75,24.23 U$1.20 | v53.03,47.32 53.03,44.58 v52.35,43.89 | v45.03,32.69 v43.66,34.06
  Bottom 0.254: v20.34,20.34 v20.34,13.49 | v20.34,32.69 19.43,33.6 19.43,34.52 19.89,34.98 20.8,34.98 24,31.77 U1.23 24.23,31.55 30.4,31.55 31.55,30.4 36.12,30.4 37.03,29.49 v37.03,26.06 | v53.03,47.32 53.03,48.69 52.12,49.61 52.12,51.21 47.78,55.55 44.35,55.55 43.89,56.01 43.89,56.92 44.35,57.38 45.49,57.38 53.26,65.15 53.26,65.84 U2.28 | v52.35,43.89 52.35,44.58 51.21,45.72 50.29,45.72 44.58,40.01 44.58,34.98 v43.66,34.06 | v45.03,26.98 v45.03,32.69
D6  (via drill 0.61)
  Top 0.254: v22.4,21.72 22.4,32.69 24,34.29 U1.24 | v46.41,26.06 42.98,26.06 42.52,25.6 38.41,25.6 37.72,24.92 36.58,24.92 36.12,25.38 35.2,25.38 33.15,23.32 33.15,15.32 v33.6,14.86 | v51.66,48.69 51.66,48.01 46.86,43.2 v46.86,33.83
  Bottom 0.254: 25.38,13.03 25.38,19.43 24.46,20.34 23.77,20.34 v22.4,21.72 | 25.38,13.03 25.38,5.94 26.52,4.8 26.52,3.89 JP1.43 | 47.32,26.52 46.86,26.52 v46.41,26.06 | 47.32,26.52 50.75,26.52 U$1.21 | v33.6,14.86 30.86,14.86 29.03,13.03 25.38,13.03 | v51.66,48.69 51.21,48.69 49.61,50.29 49.61,52.35 46.86,55.09 44.12,55.09 43.43,55.78 43.43,57.15 46.86,60.58 46.86,66.29 47.78,67.21 53.95,67.21 55.09,66.06 55.78,66.06 U2.27 | v46.86,33.83 45.95,32.92 45.95,27.89 47.32,26.52
D7  (via drill 0.61)
  Top 0.254: v17.83,22.86 17.83,33.15 18.29,33.6 18.29,36.58 18.06,36.8 18.06,37.72 18.52,38.18 22.86,38.18 | 22.86,38.18 24,37.03 U1.25 | U$1.22 50.98,29.26 50.98,30.18 53.03,32.23 53.03,38.86 59.66,45.49 59.66,51.44 58.52,52.58 58.52,65.84 U2.26 | 22.86,38.18 22.86,39.78 23.77,40.69 38.63,40.69 v46.86,32.46
  Bottom 0.254: v17.83,22.86 17.83,5.94 18.52,5.26 21.72,5.26 23.09,3.89 24,3.89 JP1.45 | v46.86,32.46 47.55,32.46 U$1.22
EXIN1
  Bottom 0.254: C11.1 80.01,44.12 75.44,39.55 50.98,39.55 U$1.26
GND  (via drill 0.61)
  Top 0.254: 62.18,24.23 61.04,24.23 60.35,23.55 60.35,22.86 IC1.16 | 62.18,24.23 62.87,23.55 IC1.14 | 64.01,27.2 64.01,26.06 63.55,25.6 | 64.01,27.2 64.01,29.95 | 62.18,24.23 63.55,25.6 | 63.55,25.6 65.38,23.77 65.38,22.86 IC1.12 65.61,22.63 65.61,21.95 67.21,20.34 | 67.89,29.26 67.89,29.95 IC2.8 67.89,29.26 | 67.89,29.26 65.84,27.2 64.01,27.2 | 67.21,20.34 68.58,20.34 C15.2 | 64.01,29.95 64.01,31.55 62.87,32.69 59.89,32.69 57.84,30.63 57.15,30.63 C13.2 | 64.01,29.95 IC2.5 | C4.2 74.98,25.38 74.98,17.6 77.27,15.32 77.27,6.4 JP1.3 | v69.27,29.26 67.89,29.26 | R4.1 80.01,17.6 82.3,15.32 86.41,15.32 | 86.41,15.32 87.55,16.46 C6.2 87.78,16.69 87.78,26.52 C3.2 | 87.55,14.17 87.55,10.29 C5.2 | 86.41,15.32 87.55,14.17 | 77.04,72.47 80.24,72.47 82.07,74.3 83.21,74.3 85.04,72.47 JP7.2 | 77.04,72.47 71.32,72.47 JP6.1 | 93.27,45.03 92.13,45.03 91.67,44.58 86.41,44.58 R2.1 | 93.27,45.03 95.1,43.2 JP4.2 95.33,42.98 95.33,38.18 JP5.2 95.33,37.95 95.33,33.15 JP2.2 95.33,32.92 96.47,31.77 96.47,26.75 C10.2 96.7,26.52 96.7,21.72 C9.2 96.7,21.49 96.7,16.69 C8.2 94.18,14.17 87.55,14.17 | 93.27,45.03 95.1,46.86 95.1,48.23 JP3.2 | 77.04,72.47 77.04,57.61 78.64,56.01 U$2.4 | JP9.3 8.69,72.47 6.4,72.47 JP9.2 | 13.95,50.75 13.95,54.41 C18.2 | 13.95,50.75 13.95,48.46 C12.2 10.29,44.58 8.91,44.58 U1.1 | C17.2 18.97,60.81 16.23,60.81 15.32,59.89 14.17,59.89 C14.2 12.8,58.52 8.46,58.52 4.8,62.18 3.89,62.18 JP8.5 | 13.95,50.75 22.86,50.75 U2.1 | U1.16 24.23,14.17 24.23,16.46 U1.17 | JP1.49 19.2,3.89 19.2,6.17 JP1.50 | IC1.10 66.52,12.8 65.61,12.8 IC1.9 65.38,12.8 65.38,13.49 64.69,14.17 | 60.12,13.72 59.66,14.17 58.52,14.17 57.84,13.49 57.84,12.8 IC1.3
  Top 0.254: 60.12,13.72 60.12,12.8 IC1.5 | 62.87,13.49 IC1.7 62.87,12.8 | 62.87,13.49 62.18,14.17 60.58,14.17 60.12,13.72 | 60.12,13.72 IC1.5 | 64.69,14.17 63.55,14.17 62.87,13.49 | JP1.17 59.89,6.4 59.89,12.34 60.12,12.57 IC1.5 | 67.21,20.34 66.06,19.2 v66.06,16 | 64.69,14.17 v64.69,14.63
  Bottom 0.254: v69.27,29.26 71.09,29.26 74.75,25.6 C4.2 | U$2.4 78.87,55.78 78.87,51.89 86.18,44.58 R2.1 | JP1.3 77.5,6.4 78.41,6.4 81.15,9.14 86.64,9.14 87.55,10.06 C5.2 | JP8.5 3.89,62.41 6.17,64.69 6.17,72.24 JP9.2 | C12.2 15.09,49.38 19.43,49.38 22.86,45.95 39.78,45.95 40.69,46.86 44.35,46.86 C16.2 | C14.2 13.95,59.66 13.95,54.63 C18.2 | JP10.1 3.89,13.95 4.57,13.95 14.63,3.89 18.97,3.89 JP1.49 19.2,3.66 20.12,3.66 21.95,1.83 41.6,1.83 43.2,3.43 43.2,5.03 44.35,6.17 JP1.29 | U1.16 24,13.95 24,13.03 19.2,8.23 19.2,6.4 JP1.50 | JP1.29 44.35,6.4 40.23,10.52 36.58,10.52 35.66,11.43 U$1.14 | JP1.17 59.66,6.17 58.52,6.17 57.61,5.26 45.49,5.26 44.58,6.17 JP1.29 | U1.1 8.91,44.35 12.34,44.35 16,40.69 16,26.06 22.86,19.2 22.86,17.83 24,16.69 U1.17 | v64.69,14.63 v66.06,16
  pour Bottom (isolate 0.406): 0,76.2 101.6,76.2 101.6,0 0,0
IOSELN
  Top 0.254: IC1.1 55.32,12.8 55.32,13.49 56.92,15.09 63.78,15.09 64.24,15.54 65.15,15.54 66.52,14.17 67.21,14.17 69.72,11.66 69.72,6.4 JP1.9
IRQN  (via drill 0.61)
  Top 0.254: 81.15,45.49 81.15,51.21 71.32,61.04 71.32,65.84 U2.21 | 81.15,45.49 81.15,36.35 80.47,35.66 77.27,35.66 75.21,33.6 75.21,32.46 76.58,31.09 76.58,20.34 83.67,13.26 83.67,8.46 80.47,5.26 79.78,5.26 78.87,4.34 78.87,3.66 77.72,2.52 74.52,2.52 73.84,3.2 73.84,4.12 72.47,5.49 72.47,6.17 JP1.7 | v41.6,36.35 39.32,38.63 37.72,38.63 37.26,38.18 30.18,38.18 29.03,39.32 24.23,39.32 U1.26 | v76.35,43.66 78.18,45.49 81.15,45.49
  Bottom 0.254: v41.6,36.35 41.6,37.03 44.12,39.55 44.12,40.23 50.06,46.18 51.44,46.18 53.95,43.66 v76.35,43.66
N$1
  Top 0.254: U$1.1 33.15,46.86 30.63,46.86 C1.1
N$2
  Top 0.254: C1.2 30.63,42.06 35.43,42.06 U$1.2
N$3
  Top 0.254: C2.1 30.63,39.55 35.43,39.55 U$1.3
N$4
  Top 0.254: C2.2 32.46,34.29 34.98,36.8 35.43,36.8 U$1.4
N$5
  Top 0.254: L1.1 78.87,40.69 78.87,44.35 R2.2
  Bottom 0.254: R2.2 76.12,41.83 50.98,41.83 U$1.27
N$6
  Bottom 0.254: 77.5,34.06 82.53,29.03 82.53,26.75 C3.1 | 77.5,34.06 77.5,37.95 L2.1 | 77.5,34.06 73.15,34.06 70.87,31.77 66.06,31.77 64.69,33.15 56.46,33.15 54.18,35.43 50.52,35.43 49.61,36.35 49.61,42.52 50.75,43.66 50.75,44.35 U$1.28
N$7
  Top 0.254: L1.2 86.41,40.46 86.41,38.18 87.55,37.03 R3.2
N$8
  Top 0.254: R3.1 80.01,36.8 77.5,36.8 73.84,33.15 Q1.2 73.84,32.92 76.12,30.63 76.12,18.97 82.53,12.57 82.53,10.29 C5.1
N$9  (via drill 0.61)
  Top 0.254: 79.32,31.09 v79.32,20.8 | 79.32,31.09 81.15,32.92 C7.1 | 79.32,31.09 77.5,32.92 76.35,32.92 Q1.1
  Bottom 0.254: v79.32,20.8 77.72,19.2 72.47,19.2 R4.2
N$10
  Top 0.254: D2.A 18.97,64.92 12.57,64.92 8.91,68.58 D1.C
N$11
  Top 0.254: C7.2 86.41,33.15 92.58,33.15 JP2.1
N$12
  Top 0.254: L3.2 88.92,21.49 88.92,19.2 91.44,16.69 C8.1
N$13
  Bottom 0.406: 0,0 0,76.2 101.6,76.2 101.6,0 0,0
N$14
  Top 0.254: JP10.3 1.83,21.03 1.83,27.89 5.03,31.09 5.03,46.86 JP11.2
N$16
  Top 0.254: C11.2 85.27,48.46 92.58,48.46 JP3.1
N$17
  Top 0.254: JP10.2 3.89,16.69 4.8,16.69 8.46,20.34 9.37,20.34 10.06,21.03 10.06,22.86 8.91,24 U1.9
N$20
  Top 0.254: JP10.4 3.89,21.72 8.69,21.72 U1.10
N$21
  Bottom 0.254: JP10.5 3.89,24 7.54,20.34 7.54,17.83 8.69,16.69 U1.12
N$22
  Top 0.254: JP10.6 3.89,26.75 8.69,26.75 U1.8
N$23
  Bottom 0.254: JP8.1 3.89,52.12 4.34,52.12 11.43,59.21 11.43,60.12 17.37,66.06 22.86,66.06 U2.40
N$24
  Top 0.254: JP8.2 3.89,54.63 6.63,54.63 9.14,57.15 16.23,57.15 18.97,59.89 19.43,59.89 25.38,65.84 U2.39
N$25
  Bottom 0.254: JP8.3 3.66,57.15 1.37,54.86 1.37,51.21 3.2,49.38 14.4,49.38 14.86,49.84 21.72,49.84 22.86,48.69 50.29,48.69 52.58,46.41 61.49,46.41 65.84,50.75 U2.18
N$26  (via drill 0.61)
  Top 0.254: v15.32,58.06 8.23,58.06 6.63,59.66 3.89,59.66 JP8.4 | v27.2,53.26 v20.12,53.26 | v50.06,55.55 v47.55,53.03 | v56.24,59.21 56.24,52.12 57.15,51.21 57.15,46.63 v58.29,45.49
  Bottom 0.254: v20.12,53.26 v15.32,58.06 | v27.2,53.26 31.55,53.26 32.92,54.63 45.95,54.63 v47.55,53.03 | v50.06,55.55 50.52,55.55 54.18,59.21 v56.24,59.21 | v58.29,45.49 63.78,45.49 68.58,50.29 U2.19
N$28  (via drill 0.61)
  Top 0.254: v17.14,69.49 22.4,74.75 85.04,74.75 88.01,71.78 88.01,57.61 86.41,56.01 U$2.5 | v3.66,36.8 v3.66,50.29
  Bottom 0.254: v17.14,69.49 5.71,58.06 5.71,54.18 4.8,53.26 2.52,53.26 1.83,52.58 1.83,51.66 3.2,50.29 v3.66,50.29 | v3.66,36.8 8.69,31.77 U1.6
PH2  (via drill 0.61)
  Top 0.254: v27.89,38.41 v30.63,35.66 | v67.44,67.67 62.64,67.67 61.27,66.29 | 61.27,66.29 61.04,66.06 U2.25 61.27,66.29 | v33.15,33.6 35.2,35.66 36.12,35.66 v38.18,37.72 | v38.18,42.98 38.18,43.66 44.58,50.06 44.58,56.24 v44.81,56.46 | 61.27,66.29 v59.66,67.89
  Bottom 0.254: v30.63,35.66 32.92,33.38 | 32.92,33.38 34.52,31.77 35.43,31.77 U$1.6 | v27.89,38.41 24.23,42.06 U1.27 | v67.44,67.67 85.04,67.67 93.95,58.75 93.95,14.86 85.5,6.4 80.01,6.4 JP1.1 | v33.15,33.6 32.92,33.38 | v38.18,42.98 v38.18,37.72 | v44.81,56.46 48.01,56.46 57.15,65.61 57.15,66.52 58.52,67.89 v59.66,67.89
POTX
  Top 0.254: C9.1 91.44,25.15 93.95,27.66 93.95,41.83 92.81,42.98 JP4.1
  Bottom 0.254: U$1.24 47.78,34.29 47.32,34.75 45.72,34.75 43.66,32.69 43.66,25.6 44.12,25.15 50.06,25.15 50.29,25.38 51.21,25.38 53.26,23.32 55.55,23.32 61.04,17.83 69.72,17.83 72.69,14.86 82.98,14.86 88.7,20.57 90.53,20.57 91.44,21.49 C9.1
POTY  (via drill 0.61)
  Top 0.254: v81.61,28.57 89.61,28.57 91.44,26.75 C10.1
  Bottom 0.254: C10.1 91.44,36.8 92.58,37.95 JP5.1 | v81.61,28.57 78.64,31.55 73.15,31.55 72.47,30.86 66.29,30.86 64.47,32.69 61.95,32.69 61.04,31.77 50.98,31.77 U$1.23
PU1  (via drill 0.61)
  Top 0.254: R1.1 62.18,26.52 60.81,26.52 57.84,23.55 57.84,22.86 IC1.18 57.61,22.63 57.61,21.95 56.69,21.03 v56.46,21.03 | v64.92,28.12 65.38,28.57 65.38,29.95 IC2.6 65.61,29.95 65.61,30.86 66.52,31.77 v66.52,32.69 | v29.49,45.03 28.35,46.18 20.8,46.18 16.23,41.6 10.97,41.6 10.74,41.83 8.91,41.83 U1.2 | v41.83,24.69 47.78,24.69 v48.69,23.77 | v70.87,37.03 70.87,38.63 67.44,42.06 67.44,66.29 66.52,67.21 65.61,67.21 64.47,66.06 63.55,66.06 U2.24
  Bottom 0.254: v64.92,28.12 63.78,28.12 62.41,26.75 R1.1 | v29.49,45.03 31.77,45.03 34.29,42.52 34.29,38.86 34.98,38.18 35.89,38.18 37.26,36.8 37.26,34.98 38.63,33.6 38.63,27.89 v41.83,24.69 | v48.69,23.77 49.38,23.77 50.29,22.86 54.63,22.86 v56.46,21.03 | v66.52,32.69 v70.87,37.03
RESN  (via drill 0.61)
  Top 0.254: v62.41,44.58 62.41,44.12 70.87,35.66 70.87,18.97 72.24,17.6 72.24,8.91 74.75,6.4 JP1.5 | v38.18,36.35 37.72,36.35 35.66,34.29 U$1.5 | v26.06,44.12 24.46,45.72 21.03,45.72 16.46,41.15 15.54,41.15 11.43,37.03 8.91,37.03 U1.4 | v38.18,47.78 39.32,48.92 39.32,51.21 38.18,52.35 38.18,65.84 U2.34
  Bottom 0.254: v62.41,44.58 53.72,44.58 51.66,46.63 48.46,46.63 47.55,45.72 | v38.18,36.35 47.55,45.72 | v26.06,44.12 26.06,42.29 31.32,37.03 32.69,37.03 35.43,34.29 U$1.5 | v38.18,47.78 38.63,47.78 38.86,48.01 45.26,48.01 47.55,45.72
RESTORE
  Bottom 0.254: JP6.3 66.06,72.47 67.89,74.3 80.7,74.3 82.53,72.47 JP7.1
ROW0
  Top 0.254: U2.10 45.72,56.92 44.58,58.06 44.58,66.29 43.2,67.67 43.2,72.24 JP6.12
ROW1
  Top 0.254: JP6.11 45.72,67.67 46.86,66.52 46.86,53.72 46.63,53.49 46.63,52.58 48.23,50.98 U2.11
ROW2
  Top 0.254: JP6.10 48.46,72.24 48.46,67.44 49.61,66.29 49.61,64.24 47.55,62.18 47.55,59.44 50.98,56.01 50.98,50.98 U2.12
ROW3
  Bottom 0.254: JP6.5 60.81,72.24 60.81,67.67 59.66,66.52 59.66,57.15 53.49,50.98 U2.13
ROW4
  Top 0.254: JP6.8 53.49,72.24 53.49,67.67 54.63,66.52 54.63,54.41 55.78,53.26 55.78,50.98 U2.14
ROW5
  Top 0.254: JP6.7 56.01,72.24 56.01,67.67 57.15,66.52 57.15,52.12 58.29,50.98 U2.15
ROW6
  Top 0.254: JP6.6 58.52,72.24 58.52,67.67 59.66,66.52 59.66,52.12 60.81,50.98 U2.16
ROW7
  Bottom 0.254: U2.17 62.18,52.12 62.18,73.61 61.49,74.3 52.81,74.3 50.98,72.47 JP6.9
RW  (via drill 0.61)
  Top 0.254: v37.26,11.43 35.89,12.8 34.29,12.8 32.69,14.4 32.69,27.2 34.52,29.03 35.43,29.03 U$1.7 | v19.89,36.35 19.89,34.52 v20.34,34.06 | v59.66,16 56.46,16 52.58,12.12 52.58,10.52 49.61,7.54 48.23,7.54 47.09,6.4 JP1.27
  Bottom 0.254: v37.26,11.43 40.92,11.43 45.95,6.4 46.86,6.4 JP1.27 | v19.89,36.35 19.89,39.32 24,43.43 24,44.35 U1.28 | v20.34,34.06 22.86,31.55 22.86,31.32 23.77,30.4 30.86,30.4 32,29.26 35.43,29.26 U$1.7 | v59.66,16 62.41,13.26 82.07,13.26 86.41,17.6 88.92,17.6 92.58,21.26 92.58,21.95 90.3,24.23 90.3,61.72 87.33,64.69 70.87,64.69 69.72,65.84 68.58,65.84 U2.22
VCC  (via drill 0.61)
  Top 0.254: v55.32,24.69 55.32,22.86 IC1.20 55.32,22.63 55.32,20.8 v56.46,19.66 | v54.41,30.86 58.98,35.43 58.98,35.89 IC2.16 59.21,36.12 59.21,44.35 61.04,46.18 61.04,49.15 62.18,50.29 62.18,63.09 v63.55,64.47 | 8.91,60.81 8.91,64.69 D2.C 8.69,64.69 3.89,64.69 JP8.6 | 8.91,60.81 8.91,59.89 C14.1 | 8.91,60.81 v14.86,60.81 | v31.55,49.61 34.29,46.86 39.32,46.86 C16.1
  Bottom 0.254: v55.32,24.69 55.32,25.83 54.63,26.52 R1.2 54.41,26.75 v54.41,30.86 | v56.46,19.66 58.52,19.66 60.81,17.37 66.06,17.37 68.12,15.32 68.58,15.32 C15.1 | v14.86,60.81 18.97,56.69 18.97,56.01 C17.1 19.2,55.78 20.12,55.78 24,51.89 24,50.52 24.92,49.61 26.75,49.61 | 26.75,49.61 v31.55,49.61 | 26.75,49.61 26.75,51.21 26.06,51.89 26.06,57.38 26.52,57.84 36.58,57.84 44.35,65.61 44.35,66.29 45.26,67.21 45.49,67.21 49.38,71.09 49.38,73.38 50.75,74.75 61.72,74.75 63.32,73.15 63.32,72.47 JP6.4 63.55,72.24 64.69,71.09 64.69,65.61 v63.55,64.47